# EAGLE schematic iNodeSocket-v0.1 (EAGLE 6.6.0)
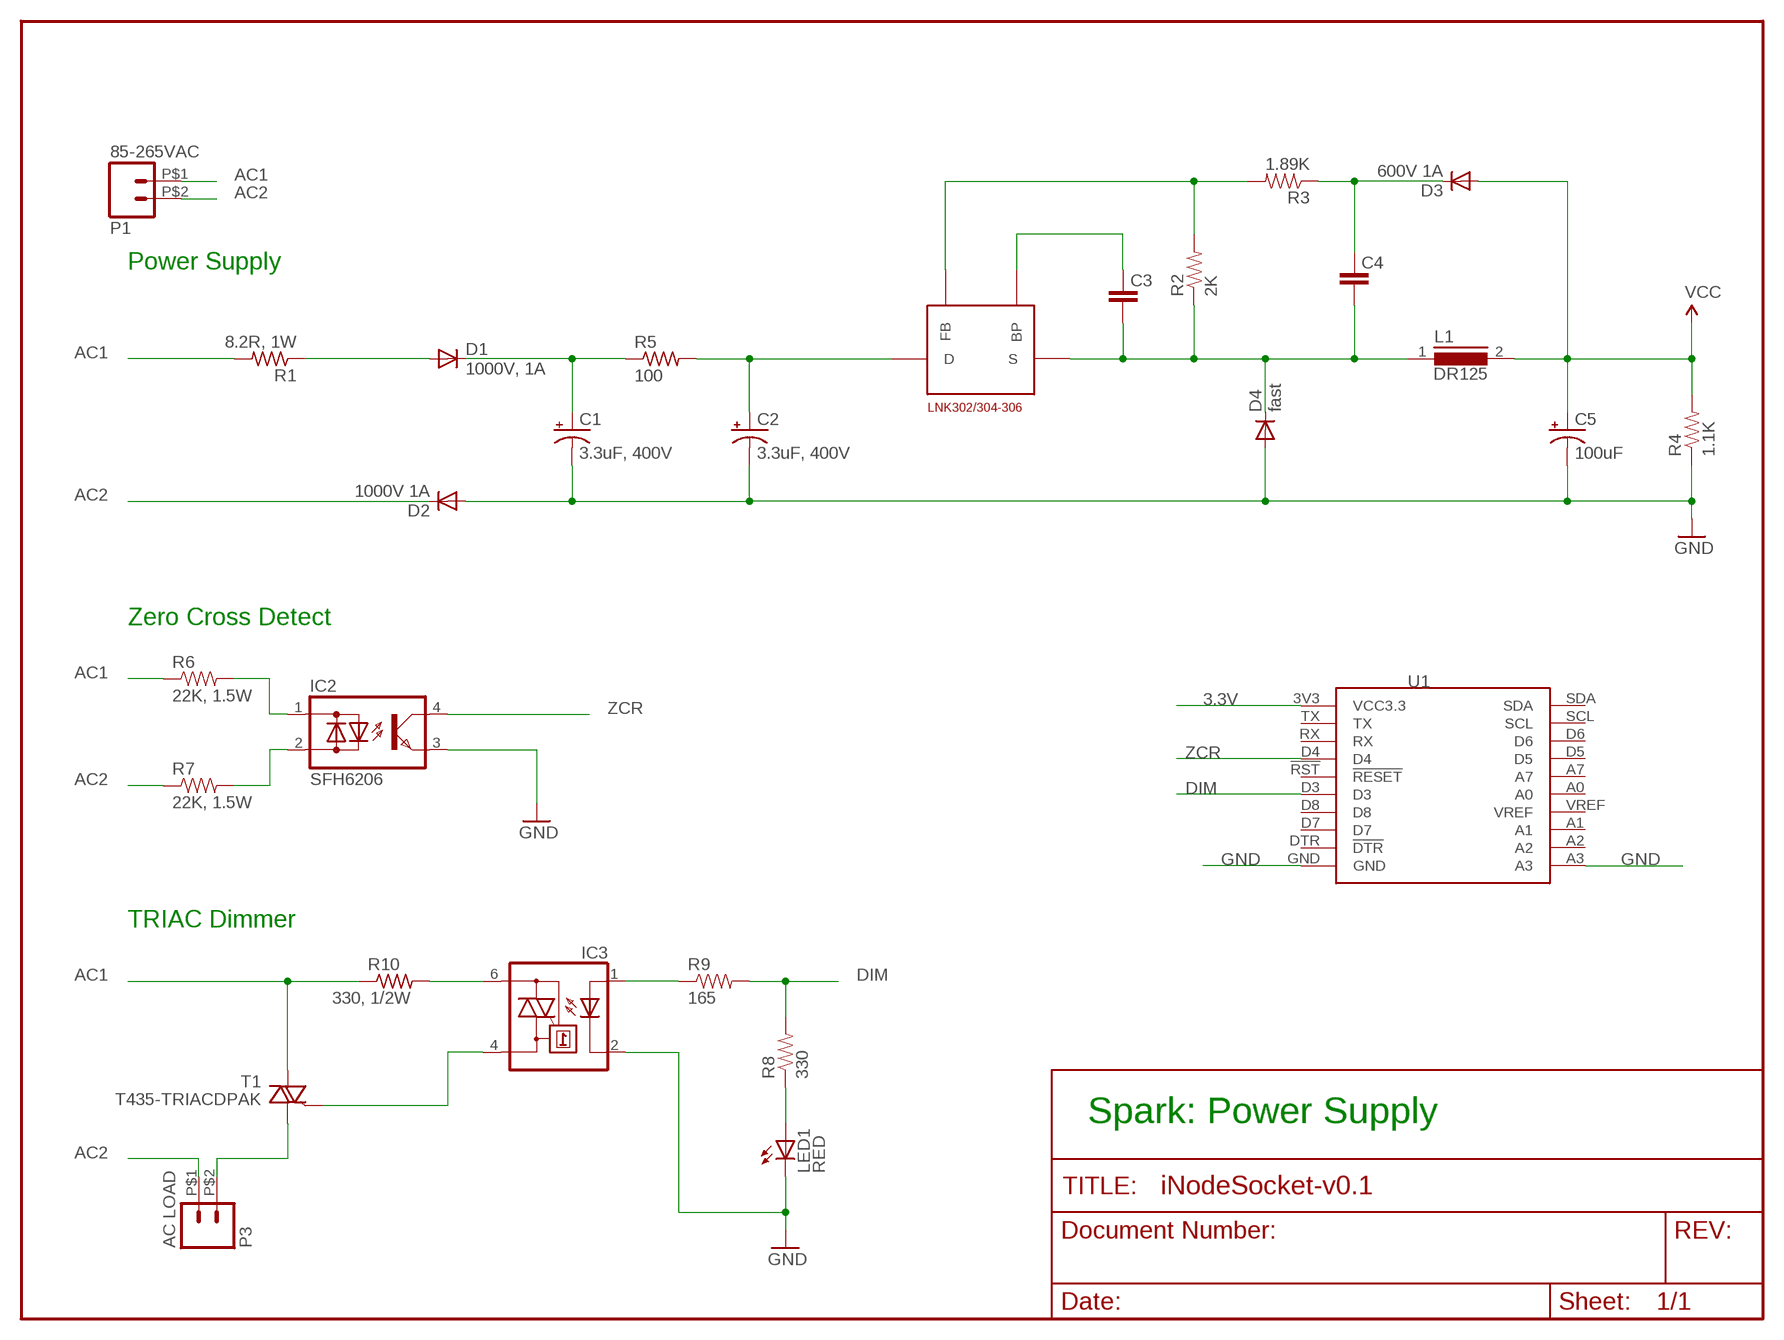
[diagram p0: schematic, sheet 1]

## Parts
C1  3.3uF, 400V  CPOL-USE3.5-8  [E3,5-8]
C2  3.3uF, 400V  CPOL-USE3.5-8  [E3,5-8]
C3  0.1uF  CAP0603-CAP  [0603-CAP]
C4  10uF, 50V  CAP0805  [0805]
C5  100uF  CAP_POL3528  [EIA3528]
D1  1000V, 1A  DIODESMA  [SMA-DIODE]
D2  1000V 1A  DIODESMA  [SMA-DIODE]
D3  600V 1A  DIODESMA  [SMA-DIODE]
D4  fast  DIODESMA  [SMA-DIODE]
IC1  LNK302/304-306  [SMD-8B]
IC2  SFH6206  [DIL4-SMD]
IC3  MOC3031S  [DIL6-SMD]
L1  DR125  [DR125]
LED1  RED  LED0603  [LED-0603]
P1  85-265VAC  M02PTH2  [1X02_BIG]
P3  AC LOAD  M02PTH2  [1X02_BIG]
R1  8.2R, 1W  R-US_0207/10  [0207/10]
R2  2K  RESISTOR0805-RES  [0805]
R3  1.89K  RESISTOR0805-RES  [0805]
R4  1.1K  RESISTOR0603-RES  [0603-RES]
R5  100  R-US_0204/7  [0204/7]
R6  22K, 1.5W  RESISTOR2512  [R2512]
R7  22K, 1.5W  RESISTOR2512  [R2512]
R8  330  RESISTOR0805-RES  [0805]
R9  165  RESISTOR0805-RES  [0805]
R10  330, 1/2W  R-US_R1210  [R1210]
T1  T435-TRIACDPAK  [TO252]
U1  BEE-IOTBEE-IOTBEE-SOCKET  [IOT_BEE_SMD]

## Nets
3.3V: C5.A(+) D3.A L1.2 R4.2 U1.3V3(VCC3.3) ; supply symbol labelled VCC
$N$100: C3.1 C4.1 D4.C IC1.S1(S) L1.1 R2.1
$N$101: C2.+ IC1.D R5.2
AC1: P1.P$1 R1.2 R6.1 R10.1 T1.2(A2)
AC2: D2.C P1.P$2 P3.P$1 R7.1
DIM: R8.2 R9.2 U1.D3
GND: C1.- C2.- C5.C(-) D2.A D4.A IC2.3(E) IC3.2(C) LED1.C R4.1 U1.A3 U1.GND
N$2: C4.2 D3.C R3.1
N$3: C3.2 IC1.BP
N$4: IC3.1(A) R9.1
N$5: IC3.6(A2) R10.2
N$6: IC3.4(A1) T1.3(G)
N$9: P3.P$2 T1.1(A1)
N$14: IC2.1(AC1) R6.2
N$16: LED1.A R8.1
N$17: C1.+ D1.C R5.1
N$18: IC1.FB R2.2 R3.2
N$26: IC2.2(AC2) R7.2
RAW_PR: D1.A R1.1
ZCR: IC2.4(C) U1.D4
Unconnected: U1.!RST(!RESET) U1.A0 U1.A1 U1.A2 U1.A7 U1.D5 U1.D6 U1.D7 U1.D8 U1.DTR(!DTR) U1.RX U1.SCL U1.SDA U1.TX U1.VREF

## Notes on the sheet
- Power Supply
- Zero Cross Detect
- TRIAC Dimmer
- Spark: Power Supply

## Library data of the parts
C1 C2 = adafruit:CPOL-US: POLARIZED CAPACITOR, American symbol
C3 C4 = SparkFun:CAP: Capacitor Standard 0603 ceramic capacitor, and 0.1" leaded capacitor.
C5 = SparkFun:CAP_POL: Capacitor Polarized These are standard SMD and PTH capacitors. Normally 10uF, 47uF, and 100uF in electrolytic and tantalum varieties. Always verify the external diameter of the through hole cap, it varies with capacity, voltage, and manufacturer. The EIA devices should be standard.
D1-D4 = SparkFun:DIODE: Diode These are standard reverse protection diodes and small signal diodes. SMA package can handle up to about 1A. SOD-323 can handle about 200mA. What the SOD-323 package when ordering, there are some mfgs out there that are 5-pin packages.
IC1 = linkswitch:LNK302/304-306
IC2 = optocoupler:SFH620: Optocoupler, Phototransistor Output, AC Input Source: http://www.vishay.com/docs/83675/sfh620.pdf; MF: VISHAY/TELEFUNKEN; MPN: SFH6206-3; OC_FARNELL: 1469585; OC_NEWARK: 58K2214
IC3 = optocoupler:MOC30*: 6-Pin DIP Zero-Cross Optoisolators Triac Driver Output (250/400 Volt Peak) Source: http://www.fairchildsemi.com/ds/MO/MOC3043-M.pdf; MF: FAIRCHILD SEMICONDUCTOR; MPN: MOC3031SM; OC_FARNELL: unknown; OC_NEWARK: 34C1335
L1 = inductors:DR125: High Power Density, High Efficiency, Shielded Inductors Source: coiltronics_dr_series.pdf
LED1 = SparkFun:LED: LEDs Standard schematic elements and footprints for 5mm, 3mm, 1206, and 0603 sized LEDs. 5mm - Spark Fun Electronics SKU : COM-00529 (and others)
P1 P3 = SparkFun:M02: Header 2 Standard 2-pin 0.1" header. Use with straight break away headers (SKU : PRT-00116), right angle break away headers (PRT-00553), swiss pins (PRT-00743), machine pins (PRT-00117), and female headers (PRT-00115). Molex polarized connector foot print use with SKU : PRT-08233 with associated crimp pins and housings.
R1 R5 R10 = adafruit:R-US_: RESISTOR, American symbol
R2-R4 R6-R9 = SparkFun:RESISTOR: Resistor Basic schematic elements and footprints for 0603, 1206, and PTH resistors.
T1 = Spark-3:T435-TRIAC
U1 = Duinopeak-Module:BEE-IOTBEE

## Net classes
2 gnd: width 0.203 mm, drill 0.559 mm, clearance 0.152 mm
3 usbvcc: width 0.203 mm, drill 0.61 mm, clearance 0.152 mm
4 aref: width 0.203 mm, drill 0.61 mm, clearance 0.152 mm